# EAGLE design LineSensor_s (EAGLE 6.4)
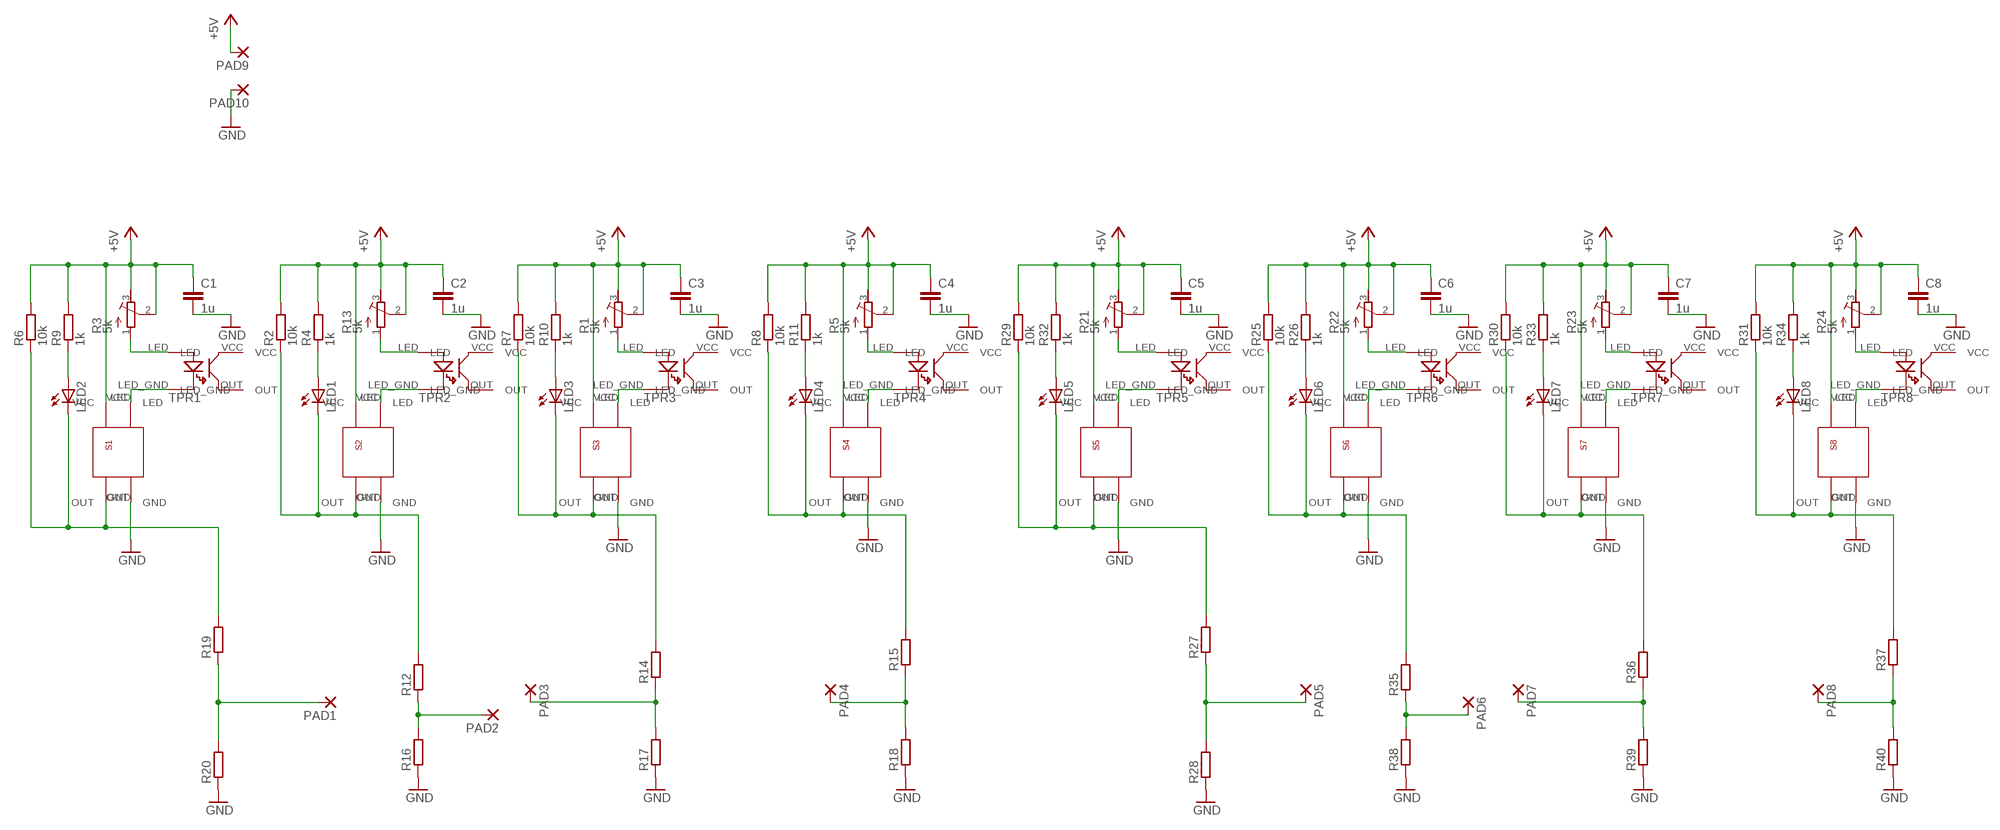
[diagram p0: schematic, sheet 1]

## Parts
C1  1u  C-EUC1005  [C1005]
C2  1u  C-EUC1005  [C1005]
C3  1u  C-EUC1005  [C1005]
C4  1u  C-EUC1005  [C1005]
C5  1u  C-EUC1005  [C1005]
C6  1u  C-EUC1005  [C1005]
C7  1u  C-EUC1005  [C1005]
C8  1u  C-EUC1005  [C1005]
LED1  LEDSMT1206  [1206]
LED2  LEDSMT1206  [1206]
LED3  LEDSMT1206  [1206]
LED4  LEDSMT1206  [1206]
LED5  LEDSMT1206  [1206]
LED6  LEDSMT1206  [1206]
LED7  LEDSMT1206  [1206]
LED8  LEDSMT1206  [1206]
PAD1  SMD5  [SMD2,54-5,08]
PAD2  SMD5  [SMD2,54-5,08]
PAD3  SMD5  [SMD2,54-5,08]
PAD4  SMD5  [SMD2,54-5,08]
PAD5  SMD5  [SMD2,54-5,08]
PAD6  SMD5  [SMD2,54-5,08]
PAD7  SMD5  [SMD2,54-5,08]
PAD8  SMD5  [SMD2,54-5,08]
PAD9  SMD5  [SMD2,54-5,08]
PAD10  SMD5  [SMD2,54-5,08]
R1  5k  R-TRIMM3374  [RTRIM3374]
R2  10k  R-EU_R2012  [R2012]
R3  5k  R-TRIMM3374  [RTRIM3374]
R4  1k  R-EU_R2012  [R2012]
R5  5k  R-TRIMM3374  [RTRIM3374]
R6  10k  R-EU_R2012  [R2012]
R7  10k  R-EU_R2012  [R2012]
R8  10k  R-EU_R2012  [R2012]
R9  1k  R-EU_R2012  [R2012]
R10  1k  R-EU_R2012  [R2012]
R11  1k  R-EU_R2012  [R2012]
R12  R-EU_R2012  [R2012]
R13  5k  R-TRIMM3374  [RTRIM3374]
R14  R-EU_R2012  [R2012]
R15  R-EU_R2012  [R2012]
R16  R-EU_R2012  [R2012]
R17  R-EU_R2012  [R2012]
R18  R-EU_R2012  [R2012]
R19  R-EU_R2012  [R2012]
R20  R-EU_R2012  [R2012]
R21  5k  R-TRIMM3374  [RTRIM3374]
R22  5k  R-TRIMM3374  [RTRIM3374]
R23  5k  R-TRIMM3374  [RTRIM3374]
R24  5k  R-TRIMM3374  [RTRIM3374]
R25  10k  R-EU_R2012  [R2012]
R26  1k  R-EU_R2012  [R2012]
R27  R-EU_R2012  [R2012]
R28  R-EU_R2012  [R2012]
R29  10k  R-EU_R2012  [R2012]
R30  10k  R-EU_R2012  [R2012]
R31  10k  R-EU_R2012  [R2012]
R32  1k  R-EU_R2012  [R2012]
R33  1k  R-EU_R2012  [R2012]
R34  1k  R-EU_R2012  [R2012]
R35  R-EU_R2012  [R2012]
R36  R-EU_R2012  [R2012]
R37  R-EU_R2012  [R2012]
R38  R-EU_R2012  [R2012]
R39  R-EU_R2012  [R2012]
R40  R-EU_R2012  [R2012]
S1  S-IC  [S-IC]
S2  S-IC  [S-IC]
S3  S-IC  [S-IC]
S4  S-IC  [S-IC]
S5  S-IC  [S-IC]
S6  S-IC  [S-IC]
S7  S-IC  [S-IC]
S8  S-IC  [S-IC]
TPR1  TPR  [TPR]
TPR2  TPR  [TPR]
TPR3  TPR  [TPR]
TPR4  TPR  [TPR]
TPR5  TPR  [TPR]
TPR6  TPR  [TPR]
TPR7  TPR  [TPR]
TPR8  TPR  [TPR]

## Nets
+5V: C1.1 C2.1 C3.1 C4.1 C5.1 C6.1 C7.1 C8.1 PAD9.1(P) R1.2(S) R1.3(A) R2.2 R3.2(S) R3.3(A) R4.2 R5.2(S) R5.3(A) R6.2 R7.2 R8.2 R9.2 R10.2 R11.2 R13.2(S) R13.3(A) R21.2(S) R21.3(A) R22.2(S) R22.3(A) R23.2(S) R23.3(A) R24.2(S) R24.3(A) R25.2 R26.2 R29.2 R30.2 R31.2 R32.2 R33.2 R34.2 S1.VCC S2.VCC S3.VCC S4.VCC S5.VCC S6.VCC S7.VCC S8.VCC
GND: C1.2 C2.2 C3.2 C4.2 C5.2 C6.2 C7.2 C8.2 PAD10.1(P) R16.1 R17.1 R18.1 R20.1 R28.1 R38.1 R39.1 R40.1 S1.GND S2.GND S3.GND S4.GND S5.GND S6.GND S7.GND S8.GND
N$1: S2.LED TPR2.LED_GND
N$2: R13.1(E) TPR2.LED
N$3: S1.LED TPR1.LED_GND
N$4: R3.1(E) TPR1.LED
N$5: LED2.C R6.1 R19.2 S1.OUT
N$6: LED2.A R9.1
N$7: LED1.C R2.1 R12.2 S2.OUT
N$8: LED1.A R4.1
N$9: S3.LED TPR3.LED_GND
N$10: R1.1(E) TPR3.LED
N$11: LED3.C R7.1 R14.2 S3.OUT
N$12: LED3.A R10.1
N$13: S4.LED TPR4.LED_GND
N$14: R5.1(E) TPR4.LED
N$15: LED4.C R8.1 R15.2 S4.OUT
N$16: LED4.A R11.1
N$18: PAD2.1(P) R12.1 R16.2
N$19: PAD3.1(P) R14.1 R17.2
N$20: PAD4.1(P) R15.1 R18.2
N$21: S5.LED TPR5.LED_GND
N$22: R21.1(E) TPR5.LED
N$23: LED5.C R27.2 R29.1 S5.OUT
N$24: LED5.A R32.1
N$25: S6.LED TPR6.LED_GND
N$26: R22.1(E) TPR6.LED
N$27: LED6.C R25.1 R35.2 S6.OUT
N$28: LED6.A R26.1
N$29: S7.LED TPR7.LED_GND
N$30: R23.1(E) TPR7.LED
N$31: LED7.C R30.1 R36.2 S7.OUT
N$32: LED7.A R33.1
N$33: S8.LED TPR8.LED_GND
N$34: R24.1(E) TPR8.LED
N$35: LED8.C R31.1 R37.2 S8.OUT
N$36: LED8.A R34.1
N$37: PAD5.1(P) R27.1 R28.2
N$38: PAD6.1(P) R35.1 R38.2
N$39: PAD7.1(P) R36.1 R39.2
N$40: PAD8.1(P) R37.1 R40.2
N$41: PAD1.1(P) R19.1 R20.2
Unconnected: TPR1.OUT TPR2.OUT TPR3.OUT TPR4.OUT TPR5.OUT TPR6.OUT TPR7.OUT TPR8.OUT

## Power pins joined to a net without a drawn wire
VCC: TPR1.VCC TPR2.VCC TPR3.VCC TPR4.VCC TPR5.VCC TPR6.VCC TPR7.VCC TPR8.VCC

## Library data of the parts
C1-C8 = resistor:C-EU: CAPACITOR, European symbol
LED1-LED8 = led:LED: LED OSRAM: - CHIPLED LG R971, LG N971, LY N971, LG Q971, LY Q971, LO R971, LY R971 LH N974, LH R974 LS Q976, LO Q976, LY Q976 LO Q996 - Hyper CHIPLED LW Q18S LB Q993, LB Q99A, LB R99A - SideLED LS A670, LO A670, LY A670, LG A670, LP A670 LB A673, LV A673, LT A673, LW A673 LH A674 LY A675 LS A676, LA A676, LO A676, LY A676, LW A676 LS A679, LY A679, LG A679 - Hyper Micro SIDELED® LS Y876, LA Y876, LO Y876, LY Y876 LT Y87S - SmartLED LW L88C, LW L88S LB L89C, LB L89S, LG L890 LS L89K, LO L89K, LY L89K LS L896, LA L896, LO L896, LY L896 - TOPLED LS T670, LO T670, LY T670, LG T670, LP T670 LSG T670, LSP T670, LSY T670, LOP T670, LYG T670 LG T671, LOG T671, LSG T671 LB T673, LV T673, LT T673, LW T673 LH T674 LS T676, LA T676, LO T676, LY T676, LB T676, LH T676, LSB T676, LW T676 LB T67C, LV T67C, LT T67C, LS T67K, LO T67K, LY T67K, LW E67C LS E67B, LA E67B, LO E67B, LY E67B, LB E67C, LV E67C, LT E67C LW T67C LS T679, LY T679, LG T679 LS T770, LO T770, LY T770, LG T770, LP T770 LB T773, LV T773, LT T773, LW T773 LH T774 LS E675, LA E675, LY E675, LS T675 LS T776, LA T776, LO T776, LY T776, LB T776 LHGB T686 LT T68C, LB T68C - Hyper Mini TOPLED® LB M676 - Mini TOPLED Santana® LG M470 LS M47K, LO M47K, LY M47K Source: http://www.osram.convergy.de LUXEON: - LUMILED® LXK2-PW12-R00, LXK2-PW12-S00, LXK2-PW14-U00, LXK2-PW14-V00 LXK2-PM12-R00, LXK2-PM12-S00, LXK2-PM14-U00 LXK2-PE12-Q00, LXK2-PE12-R00, LXK2-PE12-S00, LXK2-PE14-T00, LXK2-PE14-U00 LXK2-PB12-K00, LXK2-PB12-L00, LXK2-PB12-M00, LXK2-PB14-N00, LXK2-PB14-P00, LXK2-PB14-Q00 LXK2-PR12-L00, LXK2-PR12-M00, LXK2-PR14-Q00, LXK2-PR14-R00 LXK2-PD12-Q00, LXK2-PD12-R00, LXK2-PD12-S00 LXK2-PH12-R00, LXK2-PH12-S00 LXK2-PL12-P00, LXK2-PL12-Q00, LXK2-PL12-R00 Source: www.luxeon.com KINGBRIGHT: KA-3528ASYC Source: www.kingbright.com
PAD1-PAD10 = wirepad:SMD5: SMD PAD
R1 R3 R5 R13 R21-R24 = resistor:R-TRIMM: Trimm resistor
R2 R4 R6-R12 R14-R20 R25-R40 = resistor:R-EU_: RESISTOR, European symbol
S1-S8 = S-IC:S-IC
TPR1-TPR8 = TPR:TPR: TPR

## Board
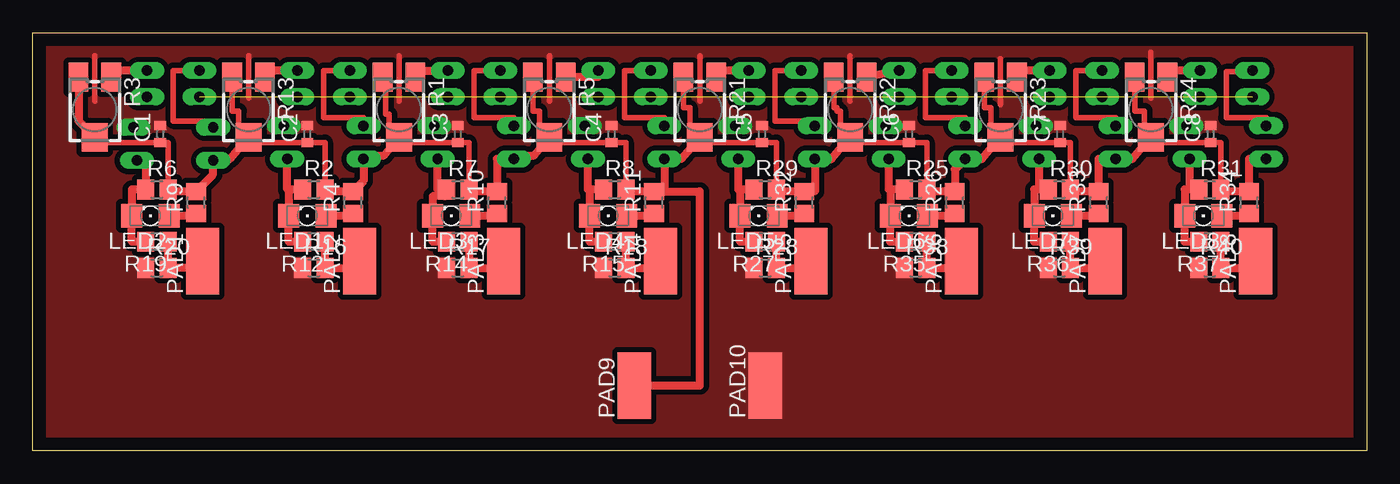
[diagram p1: board, top side]
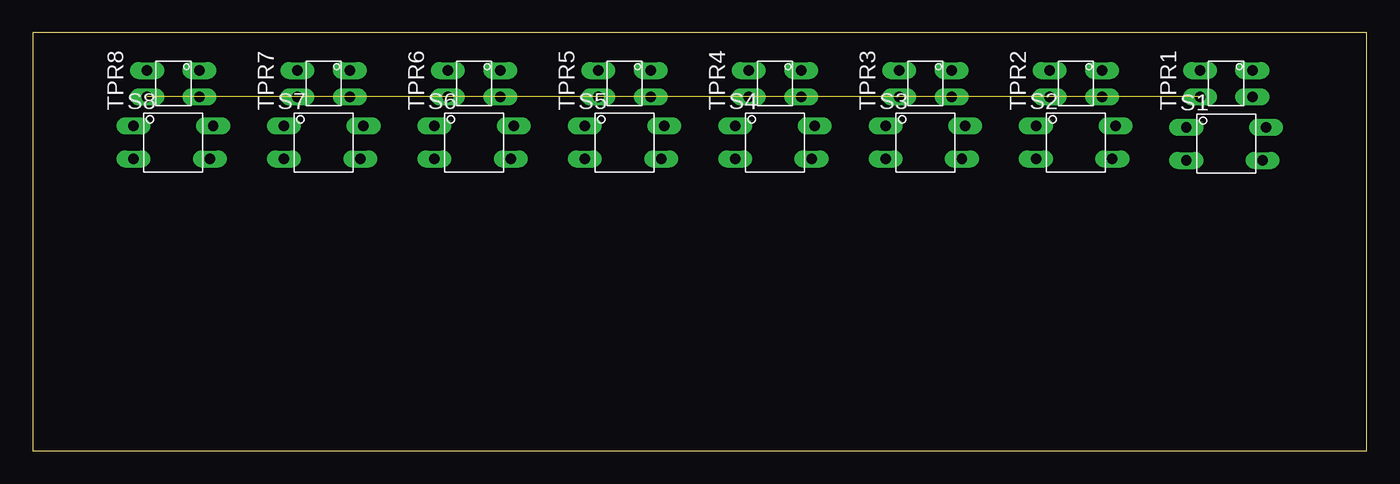
[diagram p2: board, bottom side, seen from below]

Size 102 x 32 mm. Coordinates in mm from the lower left corner, seen from the top.
Outline: 102,0 0,0 0,32 102,32 102,0
Copper layers (1*16): Top 0.035mm / dielectric 1.5mm / Bottom 0.035mm
Design rules "default": minimum track width 10mil, minimum drill 24mil, track to track 8mil, track to pad 8mil, pad to pad 8mil, via to via 8mil, smd to smd 8mil, copper to edge 40mil, drill to drill 8mil, minimum pad ring 10mil, minimum via ring 8mil, stop-mask expansion 4mil, vias tented up to drill 0mil, thermal gap 10mil

### Footprints (pad centres in the part's own frame; a part is rotated, then mirrored left to right if it is on the bottom)
C1005 = smd 0.7 x 0.9: 1 -0.65,0; 2 0.65,0
1206 = smd 1.6 x 1.803: A -1.422,0; C 1.422,0
SMD2,54-5,08 = smd 2.54 x 5.08: 1 0,0
RTRIM3374 = smd 1.5 x 2.2: 1 -1.25,-2.5; 3 1.25,-2.5 | smd 1.98 x 2.17: 2 0,2.1
R2012 = smd 1.3 x 1.5: 1 -0.85,0; 2 0.85,0
S-IC = drill 0.8 long: GND 3.048,1.27; LED -3.048,1.27; OUT 2.794,-1.27; VCC -3.048,-1.27
TPR = drill 0.8 long: LED -1,2; LED_GND -1,-2; OUT 1,2; VCC 1,-2

### Placement (x,y rotation side)
C1  9.75,24.25 90 top
C2  21,24.25 90 top
C3  32.5,24.25 90 top
C4  44.25,24.25 90 top
C5  55.75,24.25 90 top
C6  67,24.25 90 top
C7  78.55,24.25 90 top
C8  90.05,24.25 90 top
LED1  21,18 180 top
LED2  9,18 180 top
LED3  32,18 180 top
LED4  44,18 180 top
LED5  55.5,18 180 top
LED6  67,18 180 top
LED7  78,18 180 top
LED8  89.5,18 180 top
PAD1  13,14.5 0 top
PAD2  25,14.5 0 top
PAD3  36,14.5 0 top
PAD4  48,14.5 0 top
PAD5  59.5,14.5 0 top
PAD6  71,14.5 0 top
PAD7  82,14.5 0 top
PAD8  93.5,14.5 0 top
PAD9  46,5 0 top
PAD10  56,5 0 top
R1  28,26.1 180 top
R2  21.5,20 0 top
R3  4.75,26.1 180 top
R4  24.5,19 90 top
R5  39.5,26.1 180 top
R6  9.5,20 0 top
R7  32.5,20 0 top
R8  44.5,20 0 top
R9  12.5,19 90 top
R10  35.5,19 90 top
R11  47.5,19 90 top
R12  21.5,16 180 top
R13  16.5,26.1 180 top
R14  32.5,16 180 top
R15  44.5,16 180 top
R16  21.5,14 0 top
R17  32.5,14 0 top
R18  44.5,14 0 top
R19  9.5,16 180 top
R20  9.5,14 0 top
R21  51,26.1 180 top
R22  62.5,26.1 180 top
R23  74,26.1 180 top
R24  85.5,26.1 180 top
R25  67.5,20 0 top
R26  70.5,19 90 top
R27  56,16 180 top
R28  56,14 0 top
R29  56,20 0 top
R30  78.5,20 0 top
R31  90,20 0 top
R32  59,19 90 top
R33  81.5,19 90 top
R34  93,19 90 top
R35  67.5,16 180 top
R36  78.5,16 180 top
R37  90,16 180 top
R38  67.5,14 0 top
R39  78.5,14 0 top
R40  90,14 0 top
S1  10.75,23.5 0 bottom
S2  22.25,23.6 0 bottom
S3  33.75,23.6 0 bottom
S4  45.25,23.6 0 bottom
S5  56.75,23.6 0 bottom
S6  68.25,23.6 0 bottom
S7  79.75,23.6 0 bottom
S8  91.25,23.6 0 bottom
TPR1  10.75,28.1 270 bottom
TPR2  22.25,28.1 270 bottom
TPR3  33.75,28.1 270 bottom
TPR4  45.25,28.1 270 bottom
TPR5  56.75,28.1 270 bottom
TPR6  68.25,28.1 270 bottom
TPR7  79.75,28.1 270 bottom
TPR8  91.25,28.1 270 bottom

### Tracks (layer width: path | path; a pad name or v marks a point on that pad's centre or on a via)
+5V
  Top 0.406: R13.2 16,24 | 16,24 15.75,24 15.75,26 15.25,26 R13.3 | R31.2 90.85,23.6 C8.1 85.5,23.6 R24.2 85.5,24.25 85,24.25 85,26 84.25,26 R24.3 | R30.2 79.35,23.6 C7.1 74,23.6 R23.2 74,24.25 73.25,24.25 73.25,26.25 72.75,26.25 R23.3 | R25.2 68.35,23.6 C6.1 62.5,23.6 R22.2 61.75,24 61.75,26 61.5,26 61.5,26.25 61.25,26.25 R22.3 | R29.2 56.85,23.6 C5.1 51,23.6 R21.2 50.25,24 50.25,26.25 49.75,26.25 R21.3 | R8.2 45.35,23.6 C4.1 39.5,23.6 R5.2 39.5,24.75 38.75,24.75 38.75,26 38.25,26 R5.3 | R7.2 33.35,23.6 C3.1 28,23.6 R1.2 27.25,24 27.25,25.75 27,25.75 27,28.6 R1.3 | R2.2 22.35,23.6 C2.1 16,23.6 16,24 | R6.2 10.35,23.6 C1.1 4.75,23.6 R3.2
  Top 0.61: R13.2 15.08,22.33 S1.VCC 13.8,21.15 R9.2 10.35,19.85 R6.2 | R3.3 3.5,25.25 R3.2 | R1.2 26.85,22.6 25.25,22.6 S2.VCC 25.3,20.65 R4.2 22.35,19.85 R2.2 | R5.2 38.35,22.6 37.07,22.6 S3.VCC 35.5,22.33 R10.2 33.35,19.85 R7.2 | R21.2 49.58,22.33 S4.VCC 48.3,19.85 R11.2 | R22.2 61.08,22.33 S5.VCC 59.8,19.85 R32.2 56.85,19.85 R29.2 | R23.2 72.58,22.33 S6.VCC 70.5,21.53 R26.2 68.35,19.85 R25.2 | R24.2 84.08,22.33 S7.VCC 81.5,22.33 R33.2 79.35,19.85 R30.2 | 94.07,22.1 arc90 S8.VCC 93,22.33 R34.2 90.85,19.85 R31.2 | R11.2 45.35,19.85 R8.2 | PAD9.1 51,5 51,19.85 R11.2
GND
  Top 0.406: 4.75,30.25 4.75,26.75 | 16.5,30.25 16.5,27 | 28,30.25 28,26.75 | 39.5,30.25 39.5,26.75 | 51,30.25 51,26.75 | 62.5,30.25 62.5,26.75 | 74,30 74,26.5 | 85.5,30.5 85.5,27
  pour Top (isolate 0.406, no thermals): 0,32 0,0 102,0 102,32
N$1
  Top 0.406: TPR2.LED_GND 22.25,29.1 22.25,25.5 25.3,25.5 S2.LED
N$2
  Top 0.61: TPR2.LED 18.5,29.1 R13.1
N$3
  Top 0.406: TPR1.LED_GND 10.75,29.1 10.75,25.25 13.8,25.25 S1.LED
N$4
  Top 0.61: TPR1.LED 6.5,29.1
  Top 0.813: R3.1 6.5,29.1
N$5
  Top 0.61: S1.OUT 8.65,22.33 R6.1 7.58,20 LED2.C 7.58,16 R19.2
N$6
  Top 0.61: LED2.A 12.5,18 R9.1
N$7
  Top 0.61: S2.OUT 19.46,20 R2.1 19.58,20 LED1.C 19.58,16 R12.2
N$8
  Top 0.61: LED1.A 24.5,18 R4.1
N$9
  Top 0.406: TPR3.LED_GND 33.75,29.1 33.75,25.5 36.8,25.5 S3.LED
N$10
  Top 0.61: R1.1 29.5,29.1 TPR3.LED
N$11
  Top 0.61: R7.1 31.5,20 | S3.OUT 30.96,20 31.5,20 | 31.5,20 31.5,19.5 30.58,19.5 LED3.C 30.58,16 R14.2
N$12
  Top 0.61: LED3.A 35.5,18 R10.1
N$13
  Top 0.406: TPR4.LED_GND 45.25,29.1 45.25,25.5 48.3,25.5 S4.LED
N$14
  Top 0.61: TPR4.LED 43.25,28.6 R5.1
N$15
  Top 0.61: 42.9,22.33 S4.OUT 42.46,20 42.58,20 | R8.1 42.58,20 | 42.58,20 LED4.C 42.58,16 R15.2
N$16
  Top 0.61: LED4.A 47.5,18 R11.1
N$18
  Top 0.61: PAD2.1 25,14 R16.2 R12.1
N$19
  Top 0.61: PAD3.1 36,14 R17.2 R14.1
N$20
  Top 0.61: PAD4.1 48,14 R18.2 R15.1
N$21
  Top 0.406: TPR5.LED_GND 56.75,29.1 56.75,25.25 59.8,25.25 S5.LED
N$22
  Top 0.61: TPR5.LED 52.5,29.1 R21.1
N$23
  Top 0.61: R29.1 54.08,20 | 54.08,20 LED5.C 54.08,16 R27.2 | 54.08,20 53.96,20 S5.OUT
N$24
  Top 0.61: LED5.A 59,18 R32.1
N$25
  Top 0.406: TPR6.LED_GND 68.25,29.1 68.25,25.5 71.3,25.5 S6.LED
N$26
  Top 0.61: TPR6.LED R22.1
N$27
  Top 0.61: S6.OUT 65.46,20 R25.1 65.58,20 LED6.C 65.58,16 R35.2
N$28
  Top 0.61: LED6.A 70.5,18 R26.1
N$29
  Top 0.406: TPR7.LED_GND 79.75,29.1 79.75,25.5 82.8,25.5 S7.LED
  Top 0.61: 82.25,24.6 82.57,24.6 S7.LED
N$30
  Top 0.61: TPR7.LED 75.5,29.1 R23.1
N$31
  Top 0.61: S7.OUT 76.96,20 R30.1 76.58,20 LED7.C 76.58,16 R36.2
N$32
  Top 0.61: LED7.A 81.5,18 R33.1
N$33
  Top 0.406: TPR8.LED_GND 93.25,29 91.25,29 91.25,25.5 94.3,25.5 S8.LED
N$34
  Top 0.61: TPR8.LED 87,29.1 R24.1
N$35
  Top 0.61: R31.1 88.46,20 | 88.46,20 S8.OUT | 88.46,20 88.08,20 LED8.C 88.08,16 R37.2
N$36
  Top 0.61: LED8.A 93,18 R34.1
N$37
  Top 0.61: PAD5.1 59.5,14 R28.2 R27.1
N$38
  Top 0.61: PAD6.1 71,14 R38.2 R35.1
N$39
  Top 0.61: PAD7.1 82,14 R39.2 R36.1
N$40
  Top 0.61: PAD8.1 93.5,14 R40.2 R37.1
N$41
  Top 0.61: PAD1.1 13,14 R20.2 R19.1
VCC  (7 unrouted)